# EAGLE design pavement_painter_v3_larger_tolerances (EAGLE 9.1.3)
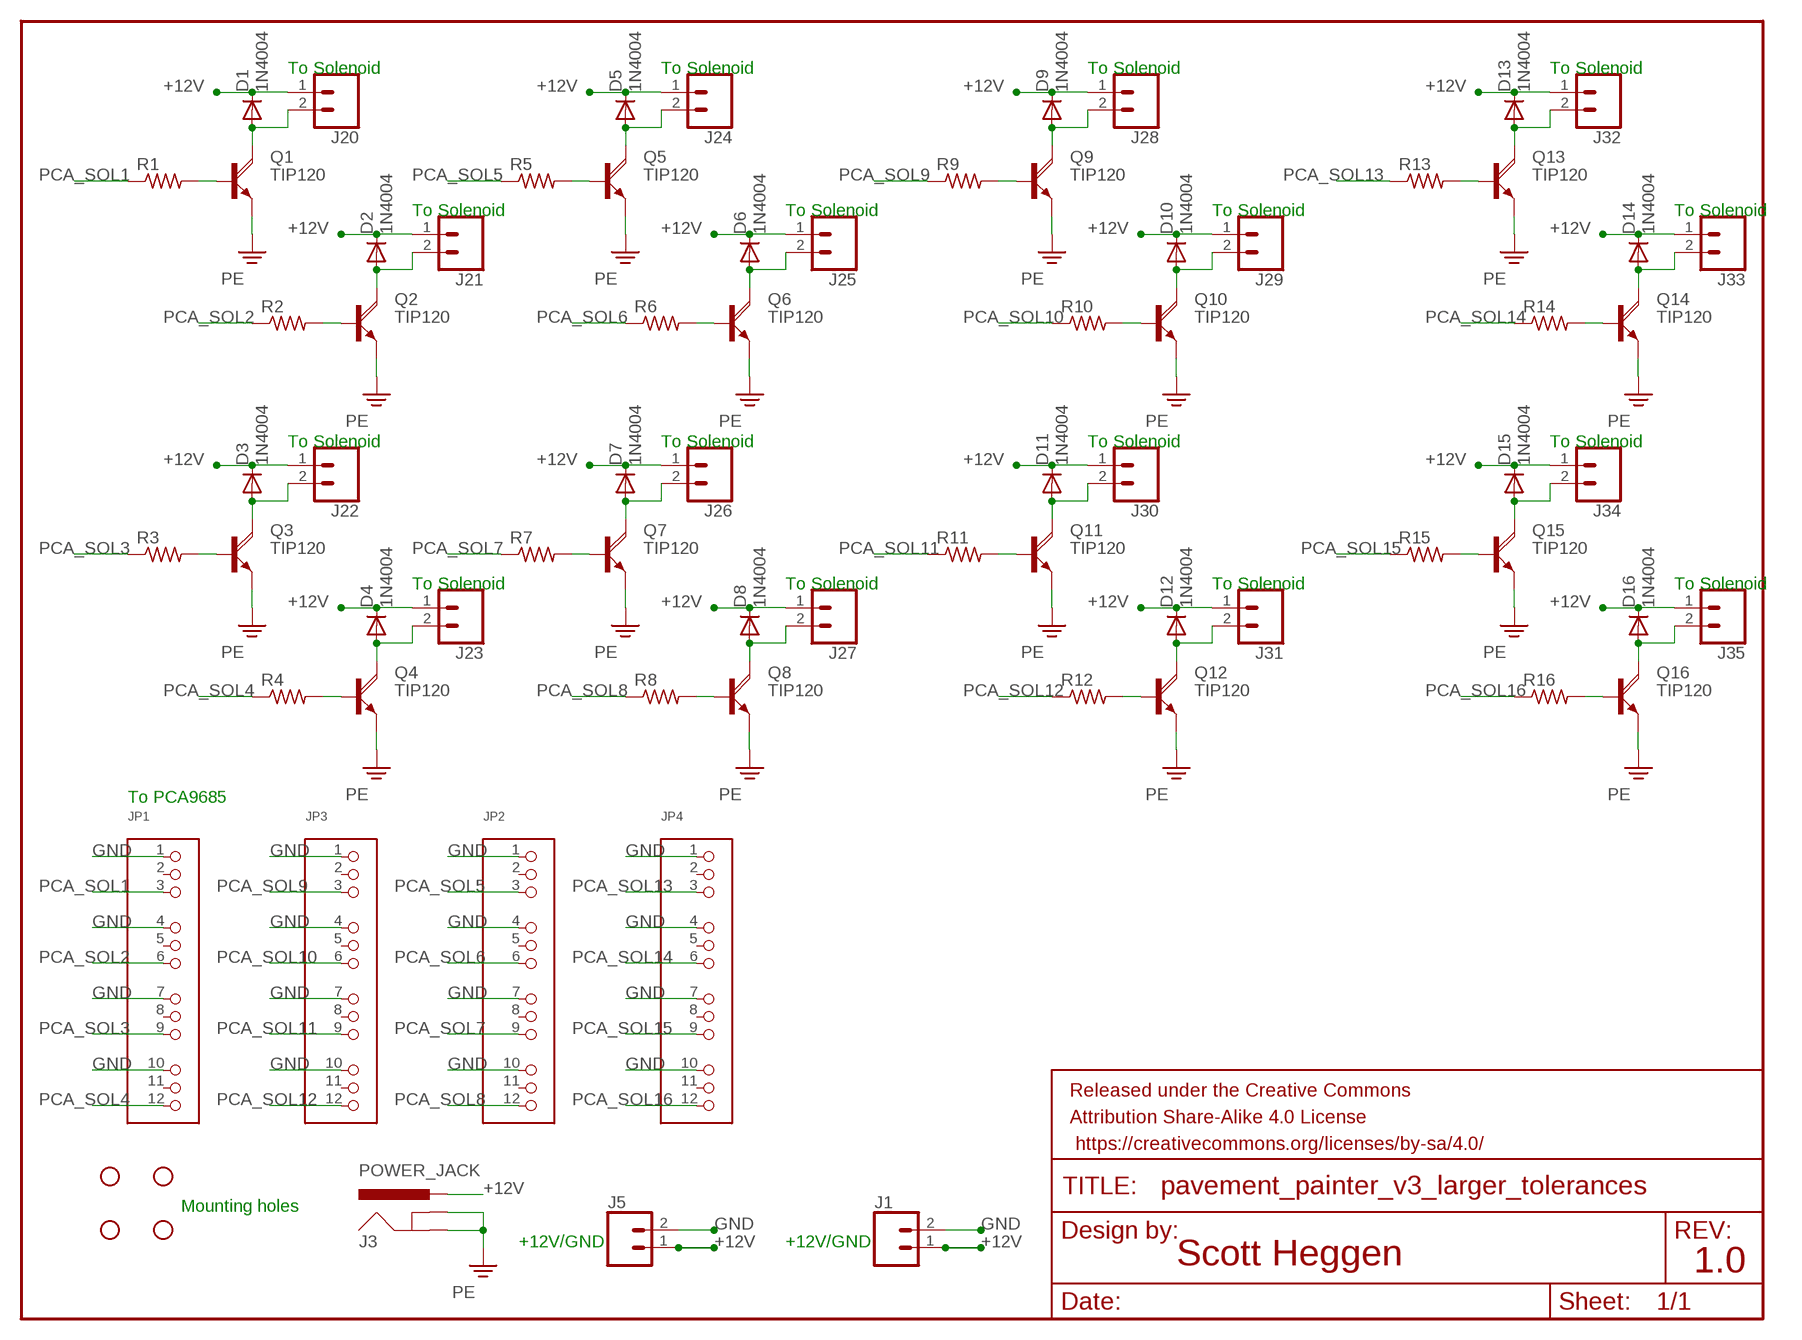
[diagram p0: schematic, sheet 1]

## Parts
D1  1N4004  [DO41-10]
D2  1N4004  [DO41-10]
D3  1N4004  [DO41-10]
D4  1N4004  [DO41-10]
D5  1N4004  [DO41-10]
D6  1N4004  [DO41-10]
D7  1N4004  [DO41-10]
D8  1N4004  [DO41-10]
D9  1N4004  [DO41-10]
D10  1N4004  [DO41-10]
D11  1N4004  [DO41-10]
D12  1N4004  [DO41-10]
D13  1N4004  [DO41-10]
D14  1N4004  [DO41-10]
D15  1N4004  [DO41-10]
D16  1N4004  [DO41-10]
FRAME1  FRAME-LETTER  [CREATIVE_COMMONS]
H1  STAND-OFF  [STAND-OFF]
H2  STAND-OFF  [STAND-OFF]
H3  STAND-OFF  [STAND-OFF]
H4  STAND-OFF  [STAND-OFF]
J1  CONN_02SCREWTERMINAL-200MIL-400MIL  [SCREWTERMINAL-5MM-2-400MIL]
J3  POWER_JACK  [POWER_JACK_PTH]
J5  CONN_02SCREWTERMINAL-200MIL-400MIL  [SCREWTERMINAL-5MM-2-400MIL]
J20  CONN_02SCREWTERMINAL-200MIL-400MIL  [SCREWTERMINAL-5MM-2-400MIL]
J21  CONN_02SCREWTERMINAL-200MIL-400MIL  [SCREWTERMINAL-5MM-2-400MIL]
J22  CONN_02SCREWTERMINAL-200MIL-400MIL  [SCREWTERMINAL-5MM-2-400MIL]
J23  CONN_02SCREWTERMINAL-200MIL-400MIL  [SCREWTERMINAL-5MM-2-400MIL]
J24  CONN_02SCREWTERMINAL-200MIL-400MIL  [SCREWTERMINAL-5MM-2-400MIL]
J25  CONN_02SCREWTERMINAL-200MIL-400MIL  [SCREWTERMINAL-5MM-2-400MIL]
J26  CONN_02SCREWTERMINAL-200MIL-400MIL  [SCREWTERMINAL-5MM-2-400MIL]
J27  CONN_02SCREWTERMINAL-200MIL-400MIL  [SCREWTERMINAL-5MM-2-400MIL]
J28  CONN_02SCREWTERMINAL-200MIL-400MIL  [SCREWTERMINAL-5MM-2-400MIL]
J29  CONN_02SCREWTERMINAL-200MIL-400MIL  [SCREWTERMINAL-5MM-2-400MIL]
J30  CONN_02SCREWTERMINAL-200MIL-400MIL  [SCREWTERMINAL-5MM-2-400MIL]
J31  CONN_02SCREWTERMINAL-200MIL-400MIL  [SCREWTERMINAL-5MM-2-400MIL]
J32  CONN_02SCREWTERMINAL-200MIL-400MIL  [SCREWTERMINAL-5MM-2-400MIL]
J33  CONN_02SCREWTERMINAL-200MIL-400MIL  [SCREWTERMINAL-5MM-2-400MIL]
J34  CONN_02SCREWTERMINAL-200MIL-400MIL  [SCREWTERMINAL-5MM-2-400MIL]
J35  CONN_02SCREWTERMINAL-200MIL-400MIL  [SCREWTERMINAL-5MM-2-400MIL]
JP1  HEADER-3X04  [3X04]
JP2  HEADER-3X04  [3X04]
JP3  HEADER-3X04  [3X04]
JP4  HEADER-3X04  [3X04]
Q1  TIP120  [BD679V]
Q2  TIP120  [BD679V]
Q3  TIP120  [BD679V]
Q4  TIP120  [BD679V]
Q5  TIP120  [BD679V]
Q6  TIP120  [BD679V]
Q7  TIP120  [BD679V]
Q8  TIP120  [BD679V]
Q9  TIP120  [BD679V]
Q10  TIP120  [BD679V]
Q11  TIP120  [BD679V]
Q12  TIP120  [BD679V]
Q13  TIP120  [BD679V]
Q14  TIP120  [BD679V]
Q15  TIP120  [BD679V]
Q16  TIP120  [BD679V]
R1  R-US_0207/10  [0207/10]
R2  R-US_0207/10  [0207/10]
R3  R-US_0207/10  [0207/10]
R4  R-US_0207/10  [0207/10]
R5  R-US_0207/10  [0207/10]
R6  R-US_0207/10  [0207/10]
R7  R-US_0207/10  [0207/10]
R8  R-US_0207/10  [0207/10]
R9  R-US_0207/10  [0207/10]
R10  R-US_0207/10  [0207/10]
R11  R-US_0207/10  [0207/10]
R12  R-US_0207/10  [0207/10]
R13  R-US_0207/10  [0207/10]
R14  R-US_0207/10  [0207/10]
R15  R-US_0207/10  [0207/10]
R16  R-US_0207/10  [0207/10]

## Nets
+12V: D1.C D2.C D3.C D4.C D5.C D6.C D7.C D8.C D9.C D10.C D11.C D12.C D13.C D14.C D15.C D16.C J1.1 J3.PWR J5.1 J20.1 J21.1 J22.1 J23.1 J24.1 J25.1 J26.1 J27.1 J28.1 J29.1 J30.1 J31.1 J32.1 J33.1 J34.1 J35.1
GND: J1.2 J3.GND J3.GNDBREAK J5.2 JP1.1 JP1.4 JP1.7 JP1.10 JP2.1 JP2.4 JP2.7 JP2.10 JP3.1 JP3.4 JP3.7 JP3.10 JP4.1 JP4.4 JP4.7 JP4.10 Q1.E Q2.E Q3.E Q4.E Q5.E Q6.E Q7.E Q8.E Q9.E Q10.E Q11.E Q12.E Q13.E Q14.E Q15.E Q16.E ; supply symbol labelled PE
N$1: D2.A J21.2 Q2.C
N$2: Q2.B R2.2
N$3: D1.A J20.2 Q1.C
N$4: Q1.B R1.2
N$5: D3.A J22.2 Q3.C
N$6: Q3.B R3.2
N$7: D4.A J23.2 Q4.C
N$8: Q4.B R4.2
N$9: D5.A J24.2 Q5.C
N$10: Q5.B R5.2
N$11: D6.A J25.2 Q6.C
N$12: Q6.B R6.2
N$13: D7.A J26.2 Q7.C
N$14: Q7.B R7.2
N$15: D8.A J27.2 Q8.C
N$16: Q8.B R8.2
N$17: D9.A J28.2 Q9.C
N$18: Q9.B R9.2
N$19: D10.A J29.2 Q10.C
N$20: Q10.B R10.2
N$21: D11.A J30.2 Q11.C
N$22: Q11.B R11.2
N$23: D12.A J31.2 Q12.C
N$24: Q12.B R12.2
N$25: D13.A J32.2 Q13.C
N$26: Q13.B R13.2
N$27: D14.A J33.2 Q14.C
N$28: Q14.B R14.2
N$29: D15.A J34.2 Q15.C
N$30: Q15.B R15.2
N$31: D16.A J35.2 Q16.C
N$32: Q16.B R16.2
PCA_SOL1: JP1.3 R1.1
PCA_SOL2: JP1.6 R2.1
PCA_SOL3: JP1.9 R3.1
PCA_SOL4: JP1.12 R4.1
PCA_SOL5: JP2.3 R5.1
PCA_SOL6: JP2.6 R6.1
PCA_SOL7: JP2.9 R7.1
PCA_SOL8: JP2.12 R8.1
PCA_SOL9: JP3.3 R9.1
PCA_SOL10: JP3.6 R10.1
PCA_SOL11: JP3.9 R11.1
PCA_SOL12: JP3.12 R12.1
PCA_SOL13: JP4.3 R13.1
PCA_SOL14: JP4.6 R14.1
PCA_SOL15: JP4.9 R15.1
PCA_SOL16: JP4.12 R16.1
Unconnected: JP1.2 JP1.5 JP1.8 JP1.11 JP2.2 JP2.5 JP2.8 JP2.11 JP3.2 JP3.5 JP3.8 JP3.11 JP4.2 JP4.5 JP4.8 JP4.11

## Notes on the sheet
- To Solenoid | To Solenoid | To Solenoid | To Solenoid
- To Solenoid | To Solenoid | To Solenoid | To Solenoid
- To Solenoid | To Solenoid | To Solenoid | To Solenoid
- To Solenoid | To Solenoid | To Solenoid | To Solenoid
- To PCA9685
- Mounting holes
- +12V/GND | +12V/GND
- Scott Heggen | 1.0

## Library data of the parts
D1-D16 = adafruit:1N4004: DIODE General purpose 1N400x type rectifier (With bigger pads) http://www.ladyada.net/library/pcb/eaglelibrary.html
FRAME1 = SparkFun-Aesthetics:FRAME-LETTER: Schematic Frame - Letter Standard 8.5x11 US Letter frame
H1-H4 = SparkFun-Hardware:STAND-OFF: Stand Off Drill holes for mechanically mounting via screws, standoffs, etc. Note: Use the keepout ring to avoid running the screw head into surrounding components. Variant Overviews STAND-OFF - Mechanical footprint for a #4 phillips button head screw. STAND-OFF-TIGHT - Mechanical footprint for a #4 phillips button head screw, Example SparkFun Products Screw - Phillips Head (1/4", 4-40, 10 pack) <https://www.sparkfun.com/products/10453> (PRT-10453) Screw - Phillips Head (1/2", 4-40, 10 pack) <https://www.sparkfun.com/products/10452> (PRT-10452) Screw - Phillips Head (3/4", 4-40, 10 pack) <https://www.sparkfun.com/products/10451> (PRT-10451) Screw - Phillips Head (1", 4-40, 10 pack) <https://www.sparkfun.com/products/10450> (PRT-10450)
J1 J5 J20-J35 = SparkFun-Connectors:CONN_02: Multi connection point. Often used as Generic Header-pin footprint for 0.1 inch spaced/style header connections On any of the 0.1 inch spaced packages, you can populate with these: Break Away Headers - Straight <https://www.sparkfun.com/products/116> (PRT-00116) Break Away Male Headers - Right Angle <https://www.sparkfun.com/products/553> (PRT-00553) Female Headers <https://www.sparkfun.com/products/115> (PRT-00115) Break Away Headers - Machine Pin <https://www.sparkfun.com/products/117> (PRT-00117) Break Away Female Headers - Swiss Machine Pin <https://www.sparkfun.com/products/743> (PRT-00743) For SCREWTERMINALS and SPRING TERMINALS visit here: Screw Terimnals on SparkFun.com <https://www.sparkfun.com/search/results?term=Screw+Terminals> (5mm/3.5mm/2.54mm spacing) This device is also useful as a general connection point to wire up your design to another part of your project. Our various solder wires solder well into these plated through hole pads. Hook-Up Wire - Assortment (Stranded, 22 AWG) <https://www.sparkfun.com/products/11375> (PRT-11375) Hook-Up Wire - Assortment (Solid Core, 22 AWG) <https://www.sparkfun.com/products/11367> (PRT-11367) View the entire wire category on our website here <https://www.sparkfun.com/categories/141> Special notes: Molex polarized connector foot print use with: PRT-08233 with associated crimp pins and housings. 2.54_SCREWTERM for use with PRT-10571. 3.5mm Screw Terminal footprints for PRT-08084 5mm Screw Terminal footprints for use with PRT-08432
J3 = SparkFun-Connectors:POWER_JACK: Power Jack Connector This is the standard 5.5mm barrel jack for power. The PTH is the most common, proven, reliable, footprint. The Slot footprint only works if the mill layer is transmitted to the PCB fab house so be warned. Here are the connectors we sell at SparkFun: DC Barrel Power Jack/Connector <https://www.sparkfun.com/products/119> (PRT-00119) DC Barrel Power Jack/Connector (SMD) <https://www.sparkfun.com/products/12748> (PRT-12748) DC Barrel Jack Adapter - Breadboard Compatible <https://www.sparkfun.com/products/10811> (PRT-10811) It is used on this SparkFun product (and many, many others): SparkFun RedBoard - Programmed with Arduino <https://www.sparkfun.com/products/12757> (DEV-12757) Also, if you need a mating power supply or connector, please check these out: Wall Adapter Power Supply - 9VDC 650mA <https://www.sparkfun.com/products/298> (TOL-00298) DC Barrel Jack Adapter - Male <https://www.sparkfun.com/products/10287> (PRT-10287); PROD_ID: CONN-08197
JP1-JP4 = microbuilder:HEADER-3X04
Q1-Q16 = TIP120:TIP120: NPN DARLINGTON TRANSISTOR
R1-R16 = rcl:R-US_: RESISTOR, American symbol; SPICEPREFIX: R

## Board
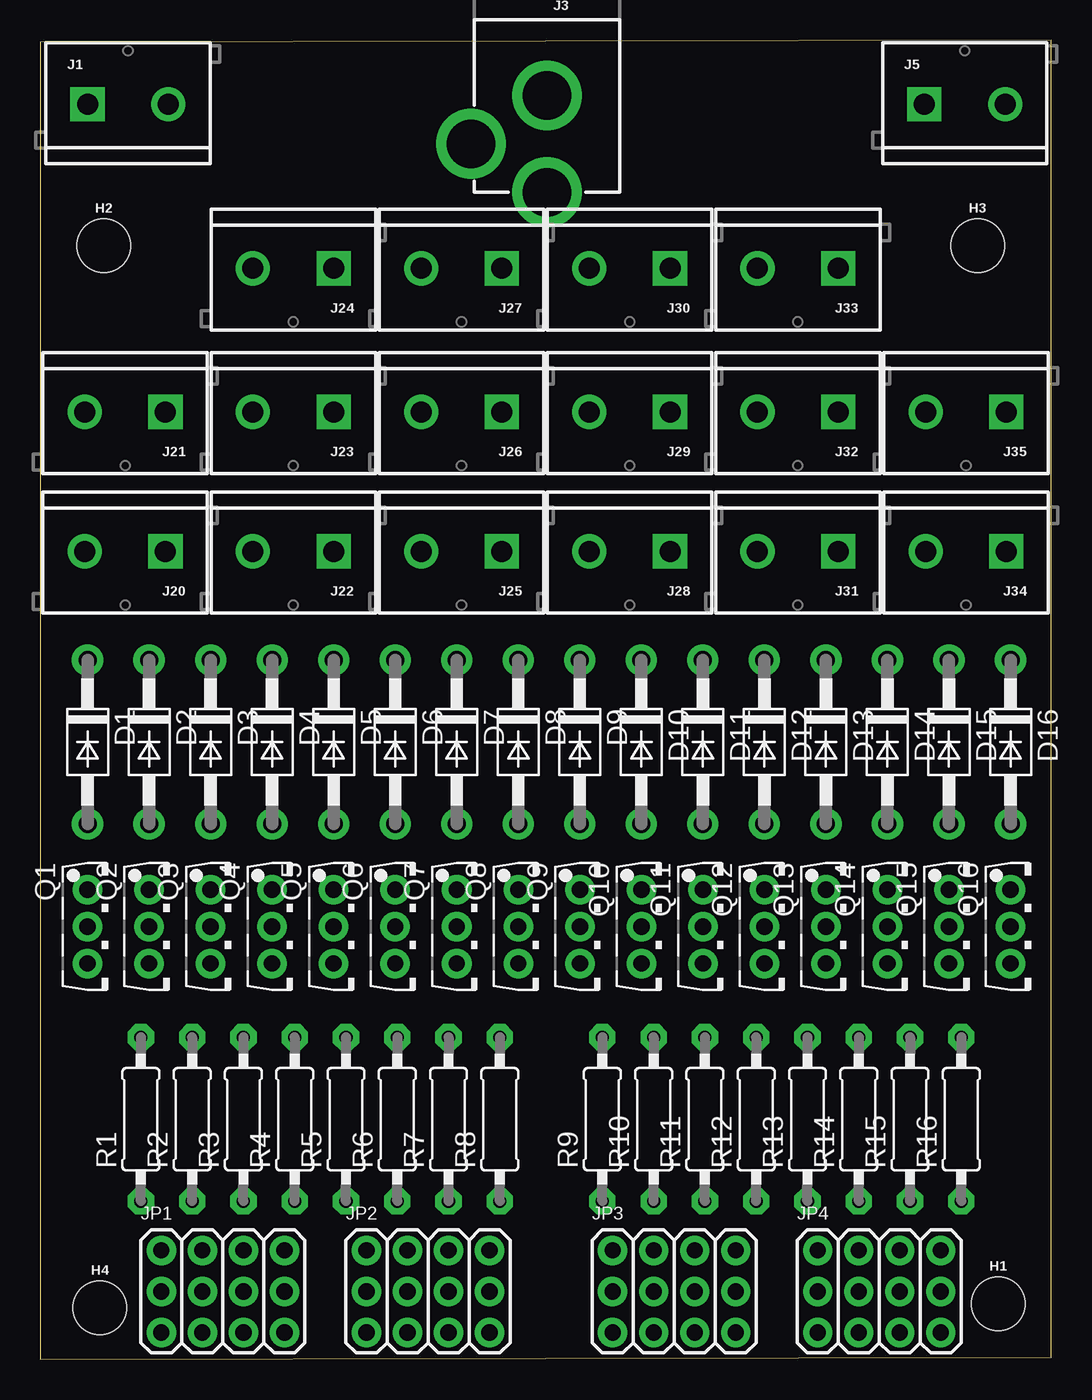
[diagram p1: board, top side]
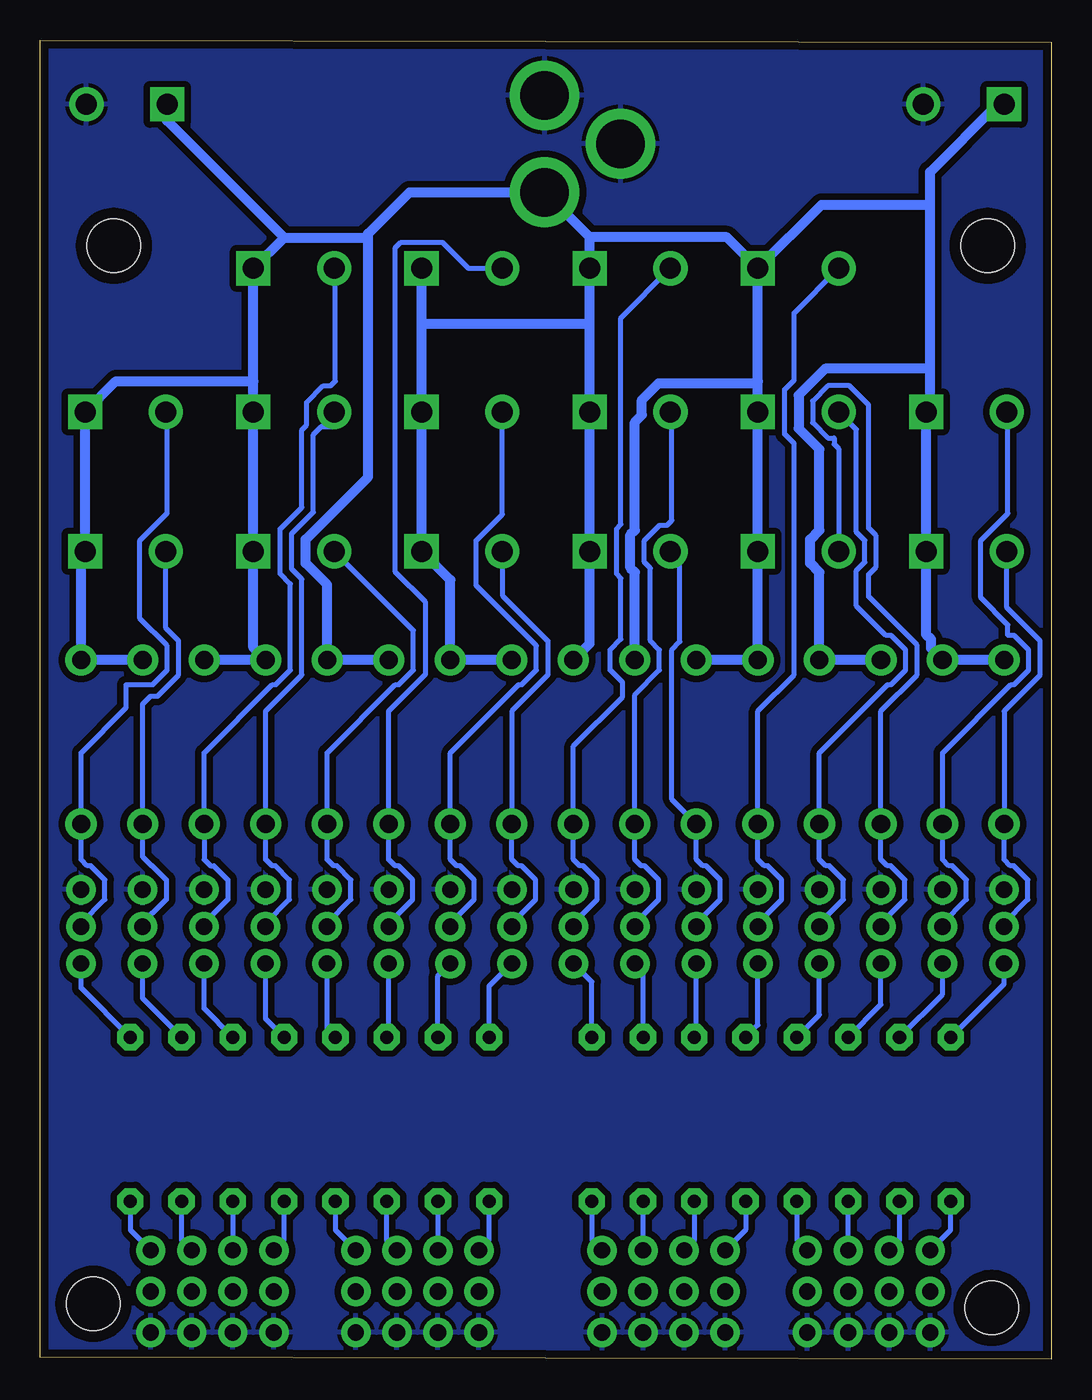
[diagram p2: board, bottom side, seen from below]

Size 62.59 x 81.69 mm. Coordinates in mm from the lower left corner, seen from the top.
Outline: 0,0 62.59,0.13 62.59,81.69 0,81.56 0,0
Copper layers (1*16): Top 0.035mm / dielectric 1.5mm / Bottom 0.035mm
Design rules "pavement *": minimum track width 12mil, minimum drill 0.35mm, track to track 16mil, track to pad 16mil, pad to pad 16mil, via to via 16mil, smd to smd 6mil, copper to edge 20mil, drill to drill 10mil, minimum pad ring 16mil, minimum via ring 8mil, stop-mask expansion 4mil, vias tented up to drill 0mil, thermal gap 10mil

### Footprints (pad centres in the part's own frame; a part is rotated, then mirrored left to right if it is on the bottom)
DO41-10 = drill 1.118 pad 1.93: A 5.08,0; C -5.08,0
STAND-OFF = hole 3.302: 0,0
SCREWTERMINAL-5MM-2-400MIL = drill 1.3 pad 2.032 square: 1 0,0.381 | drill 1.3 pad 2.032: 2 5,0.381
POWER_JACK_PTH = drill 2.997 pad 4.318: GND 0,7.7; GNDBREAK 4.7,10.7; PWR 0,13.7
3X04 = drill 1 pad 1.778: 1 -3.81,-2.54; 2 -3.81,0; 3 -3.81,2.54; 4 -1.27,-2.54; 5 -1.27,0; 6 -1.27,2.54; 7 1.27,-2.54; 8 1.27,0; 9 1.27,2.54; 10 3.81,-2.54; 11 3.81,0; 12 3.81,2.54
BD679V = drill 1.016 pad 1.778: B 2.286,-1.27; C 0,-1.27; E -2.286,-1.27
0207/10 = drill 0.813 octagon: 1 -5.08,0; 2 5.08,0

### Placement (x,y rotation side)
D1  2.92,38.23 270 top
D2  6.73,38.23 270 top
D3  10.54,38.23 270 top
D4  14.35,38.23 270 top
D5  18.16,38.23 270 top
D6  21.97,38.23 270 top
D7  25.78,38.23 270 top
D8  29.59,38.23 270 top
D9  33.4,38.23 270 top
D10  37.21,38.23 270 top
D11  41.02,38.23 270 top
D12  44.83,38.23 270 top
D13  48.64,38.23 270 top
D14  52.45,38.23 270 top
D15  56.26,38.23 270 top
D16  60.07,38.23 270 top
FRAME1  8.25,-8.76 0 top  (outside the outline)
H1  59.31,3.43 0 top
H2  3.94,68.96 0 top
H3  58.04,68.96 0 top
H4  3.68,3.17 0 top
J1  2.92,77.34 0 top
J3  31.37,85.98 180 top
J5  54.74,77.34 0 top
J20  7.75,50.42 180 top
J21  7.75,59.05 180 top
J22  18.16,50.42 180 top
J23  18.16,59.05 180 top
J24  18.16,67.94 180 top
J25  28.57,50.42 180 top
J26  28.57,59.05 180 top
J27  28.57,67.94 180 top
J28  38.99,50.42 180 top
J29  38.99,59.05 180 top
J30  38.99,67.94 180 top
J31  49.4,50.42 180 top
J32  49.4,59.05 180 top
J33  49.4,67.94 180 top
J34  59.82,50.42 180 top
J35  59.82,59.05 180 top
JP1  11.3,4.19 0 top
JP2  24,4.19 0 top
JP3  39.24,4.19 0 top
JP4  51.94,4.19 0 top
Q1  4.19,26.8 270 top
Q2  8,26.8 270 top
Q3  11.81,26.8 270 top
Q4  15.62,26.8 270 top
Q5  19.43,26.8 270 top
Q6  23.24,26.8 270 top
Q7  27.05,26.8 270 top
Q8  30.86,26.8 270 top
Q9  34.67,26.8 270 top
Q10  38.48,26.8 270 top
Q11  42.29,26.8 270 top
Q12  46.1,26.8 270 top
Q13  49.91,26.8 270 top
Q14  53.72,26.8 270 top
Q15  57.53,26.8 270 top
Q16  61.34,26.8 270 top
R1  6.22,14.86 90 top
R2  9.4,14.86 90 top
R3  12.57,14.86 90 top
R4  15.75,14.86 90 top
R5  18.92,14.86 90 top
R6  22.1,14.86 90 top
R7  25.27,14.86 90 top
R8  28.45,14.86 90 top
R9  34.8,14.86 90 top
R10  37.97,14.86 90 top
R11  41.15,14.86 90 top
R12  44.32,14.86 90 top
R13  47.5,14.86 90 top
R14  50.67,14.86 90 top
R15  53.85,14.86 90 top
R16  57.02,14.86 90 top

### Tracks (layer width: path | path; a pad name or v marks a point on that pad's centre or on a via)
+12V
  Bottom 0.61: D1.C D2.C 7.44,44.02 7.44,44.59 7.75,44.9 J20.1 J21.1 7.49,58.93 7.49,61.34 | D3.C D4.C 14.35,48.73 14.93,49.31 14.93,50.77 14.35,51.35 14.35,56.36 15.64,57.65 15.64,59.7 14,61.34 7.49,61.34 | D6.C D5.C J22.1 J23.1 18.16,60.58 | 18.16,60.58 J24.1 | D7.C 25.78,48.74 26.05,49.01 26.05,51.07 25.78,51.34 25.78,58.04 25.34,58.48 25.34,59.41 24.31,60.44 18.3,60.44 18.16,60.58 | D8.C 28.57,44.32 J25.1 J26.1 28.57,63.88 | 28.57,63.88 J27.1 28.57,69.48 | 28.57,69.48 J3.PWR 39.73,72.28 42.29,69.72 42.29,69.47 | D9.C D10.C 37.21,48.26 J28.1 J29.1 38.99,64.13 | 38.99,64.13 J30.1 | D11.C D12.C 44.83,47.97 46.17,49.31 46.17,50.77 42.29,54.65 42.29,69.47 | D14.C D13.C 49.4,44.07 J31.1 J32.1 49.4,60.58 | 49.4,60.58 J33.1 47.5,69.47 | 47.5,69.47 42.29,69.47 | D15.C D16.C 60.07,49.78 J34.1 J35.1 57.91,60.58 49.4,60.58 | 47.5,69.47 54.74,76.71 J5.1 | J24.1 14.22,71.5 7.49,71.5 | 7.49,71.5 7.49,73.53 3.3,77.72 J1.1 | 7.49,61.34 7.49,71.5 | J24.1 20.08,69.48 28.57,69.48 | 38.99,64.13 28.83,64.13 28.57,63.88
GND
  pour Bottom (isolate 0.406): 0.38,0.13 0.38,81.66 62.61,81.66 62.61,0.13
N$1
  Bottom 0.305: Q2.C 6.73,27 5.26,28.47 5.26,29.69 6.12,30.56 6.34,30.56 6.73,30.95 D2.A 6.73,37.56 2.5,41.78 2.29,41.78 1.4,42.68 1.4,43.94 2.29,44.83 2.68,44.83 2.68,45.48 4.36,47.16 4.36,50.71 2.68,52.39 2.68,58.61 J21.2
N$2
  Bottom 0.305: R2.2 6.73,22.61 Q2.B
N$3
  Bottom 0.305: 2.92,32.89 2.92,30.95 2.53,30.56 2.31,30.56 1.45,29.69 1.45,28.47 2.92,27 Q1.C | 2.92,32.89 D1.A | 2.92,32.89 2.92,40.15 0.69,42.38 0.69,44.49 2.75,46.55 J20.2
N$4
  Bottom 0.305: R1.2 2.92,23.24 Q1.B
N$5
  Bottom 0.305: Q3.C 10.54,27 9.07,28.47 9.07,29.69 9.93,30.56 10.15,30.56 10.54,30.95 D3.A 10.54,40.15 8.31,42.38 8.31,44.23 11.3,47.23 11.3,48.61 10.84,49.07 10.84,51 11.3,51.47 11.3,59.1 12.49,60.29 13.83,60.29 14.78,59.34 14.78,58.01 13.83,57.06 13.44,57.06 13.44,56.66 13.16,56.39 J22.2
N$6
  Bottom 0.305: R3.2 10.54,21.97 Q3.B
N$7
  Bottom 0.305: Q4.C 14.35,27 12.88,28.47 12.88,29.69 13.74,30.56 13.96,30.56 14.35,30.95 D4.A 14.35,37.56 10.12,41.78 9.91,41.78 9.02,42.68 9.02,43.94 9.91,44.83 10.24,44.83 12.06,46.66 12.06,48.85 11.55,49.37 11.55,50.71 12.06,51.23 12.06,57.58 J23.2
N$8
  Bottom 0.305: R4.2 14.35,21.34 Q4.B
N$9
  Bottom 0.305: Q5.C 18.16,27 16.69,28.47 16.69,29.69 17.55,30.56 17.77,30.56 18.16,30.95 D5.A 18.16,40.15 15.93,42.38 15.93,56.71 16.5,57.29 16.5,60.06 15.93,60.64 15.93,64.8 J24.2
N$10
  Bottom 0.305: R5.2 18.16,20.7 Q5.B
N$11
  Bottom 0.305: Q6.C 21.97,27 20.5,28.47 20.5,29.69 21.36,30.56 21.58,30.56 21.97,30.95 D6.A 23.5,34.67 23.5,43.94 22.99,44.45 22.99,49.45 J25.2
N$12
  Bottom 0.305: R6.2 21.97,20.07 Q6.B
N$13
  Bottom 0.305: Q7.C 25.78,27 24.31,28.47 24.31,29.69 25.17,30.56 25.39,30.56 25.78,30.95 D7.A 25.78,41.15 24.26,42.68 24.26,43.94 24.82,44.5 24.82,49 25.19,49.37 25.19,50.71 24.24,51.65 23.79,51.65 23.5,51.94 23.5,58.59 J26.2
N$14
  Bottom 0.305: R7.2 25.27,24 Q7.B
N$15
  Bottom 0.305: Q8.C 29.59,27 28.12,28.47 28.12,29.69 28.98,30.56 29.2,30.56 29.59,30.95 D8.A 29.59,37.97 26.54,41.02 26.54,41.91 27.3,42.68 27.3,43.94 26.64,44.6 26.64,48.38 26.92,48.65 26.92,51.42 26.64,51.7 26.64,64.49 J27.2
N$16
  Bottom 0.305: R8.2 28.45,23.37 Q8.B
N$17
  Bottom 0.305: Q9.C 33.4,27 31.93,28.47 31.93,29.69 32.79,30.56 33.01,30.56 33.4,30.95 D9.A 33.4,40.15 31.17,42.38 31.17,44.49 33.99,47.31 J28.2
N$18
  Bottom 0.305: R9.2 34.8,23.11 Q9.B
N$19
  Bottom 0.305: Q10.C 37.21,27 35.74,28.47 35.74,29.69 36.6,30.56 36.82,30.56 37.21,30.95 D10.A 37.21,37.56 32.98,41.78 32.77,41.78 31.88,42.68 31.88,44.19 35.6,47.92 35.6,50.71 33.99,52.32 J29.2
N$20
  Bottom 0.305: R10.2 37.97,23.75 Q10.B
N$21
  Bottom 0.305: Q11.C 41.02,27 39.55,28.47 39.55,29.69 40.41,30.56 40.63,30.56 41.02,30.95 D11.A 41.02,40.15 38.73,42.43 38.73,46.88 40.6,48.75 40.6,68.85 40.28,69.18 37.7,69.18 36.09,67.56 J30.2
N$22
  Bottom 0.305: R11.2 41.02,20.07 Q11.B
N$23
  Bottom 0.305: Q12.C 44.83,27 43.36,28.47 43.36,29.69 44.22,30.56 44.44,30.56 44.83,30.95 D12.A 44.83,37.56 40.6,41.78 40.39,41.78 39.5,42.68 39.5,45.13 J31.2
N$24
  Bottom 0.305: R12.2 44.83,20.45 Q12.B
N$25
  Bottom 0.305: Q13.C 48.64,27 47.17,28.47 47.17,29.69 48.03,30.56 48.25,30.56 48.64,30.95 D13.A 48.64,40.15 46.41,42.38 46.41,48.32 47.03,48.95 47.03,51.13 45.7,52.47 45.7,57.26 45.19,57.77 44.4,57.77 J32.2
N$26
  Bottom 0.305: R13.2 48.64,21.08 Q13.B
N$27
  Bottom 0.305: Q14.C 52.45,27.21 52.36,27.3 51.94,27.3 51.94,27.51 50.98,28.47 50.98,29.69 51.84,30.56 52.06,30.56 52.45,30.95 D14.A 52.45,37.56 48.23,41.78 48.01,41.78 47.12,42.68 47.12,48.03 47.74,48.65 47.74,51.42 46.41,52.76 46.41,57.56 46.1,57.86 46.1,59.26 45.07,60.29 44.61,60.29 44.32,60.58 44.32,67.48 J33.2
N$28
  Bottom 0.305: R14.2 52.45,21.72 Q14.B
N$29
  Bottom 0.305: Q15.C 56.26,27.21 56.1,27.21 55.7,27.61 55.65,27.61 54.79,28.47 54.79,29.69 55.65,30.56 55.7,30.56 56.26,31.11 D15.A 56.26,40.58 55.77,41.07 55.34,41.07 54.03,42.38 54.03,44.49 54.82,45.28 J34.2
N$30
  Bottom 0.305: R15.2 56.26,22.35 Q15.B
N$31
  Bottom 0.305: Q16.C 60.07,27 58.6,28.47 58.6,29.69 59.46,30.56 59.68,30.56 60.07,30.95 D16.A 60.07,37.56 57.28,40.35 57.28,41.78 55.63,41.78 54.74,42.68 54.74,44.19 56.43,45.89 56.43,50.71 54.74,52.4 54.74,58.59 J35.2
N$32
  Bottom 0.305: R16.2 60.07,22.99 Q16.B
PCA_SOL1
  Bottom 0.305: R1.1 6.22,8 JP1.3
PCA_SOL2
  Bottom 0.305: R2.1 9.4,7.37 JP1.6
PCA_SOL3
  Bottom 0.305: JP1.9 R3.1
PCA_SOL4
  Bottom 0.305: R4.1 15.75,7.37 JP1.12
PCA_SOL5
  Bottom 0.305: R5.1 18.92,8 JP2.3
PCA_SOL6
  Bottom 0.305: R6.1 22.1,7.37 JP2.6
PCA_SOL7
  Bottom 0.305: JP2.9 R7.1
PCA_SOL8
  Bottom 0.305: R8.1 28.45,7.37 JP2.12
PCA_SOL9
  Bottom 0.305: R9.1 34.8,7.37 JP3.3
PCA_SOL10
  Bottom 0.305: R10.1 JP3.6
PCA_SOL11
  Bottom 0.305: R11.1 41.15,7.37 JP3.9
PCA_SOL12
  Bottom 0.305: R12.1 44.32,8 JP3.12
PCA_SOL13
  Bottom 0.305: R13.1 47.5,7.37 JP4.3
PCA_SOL14
  Bottom 0.305: R14.1 JP4.6
PCA_SOL15
  Bottom 0.305: R15.1 53.85,7.37 JP4.9
PCA_SOL16
  Bottom 0.305: R16.1 57.02,8 JP4.12

### Text on the board
Notes: NOTE: Middle row should be raised higher / to make connections. Use 100 mil female header, / and remove every other post.